# EAGLE schematic pk4017 (EAGLE 7.7.0)
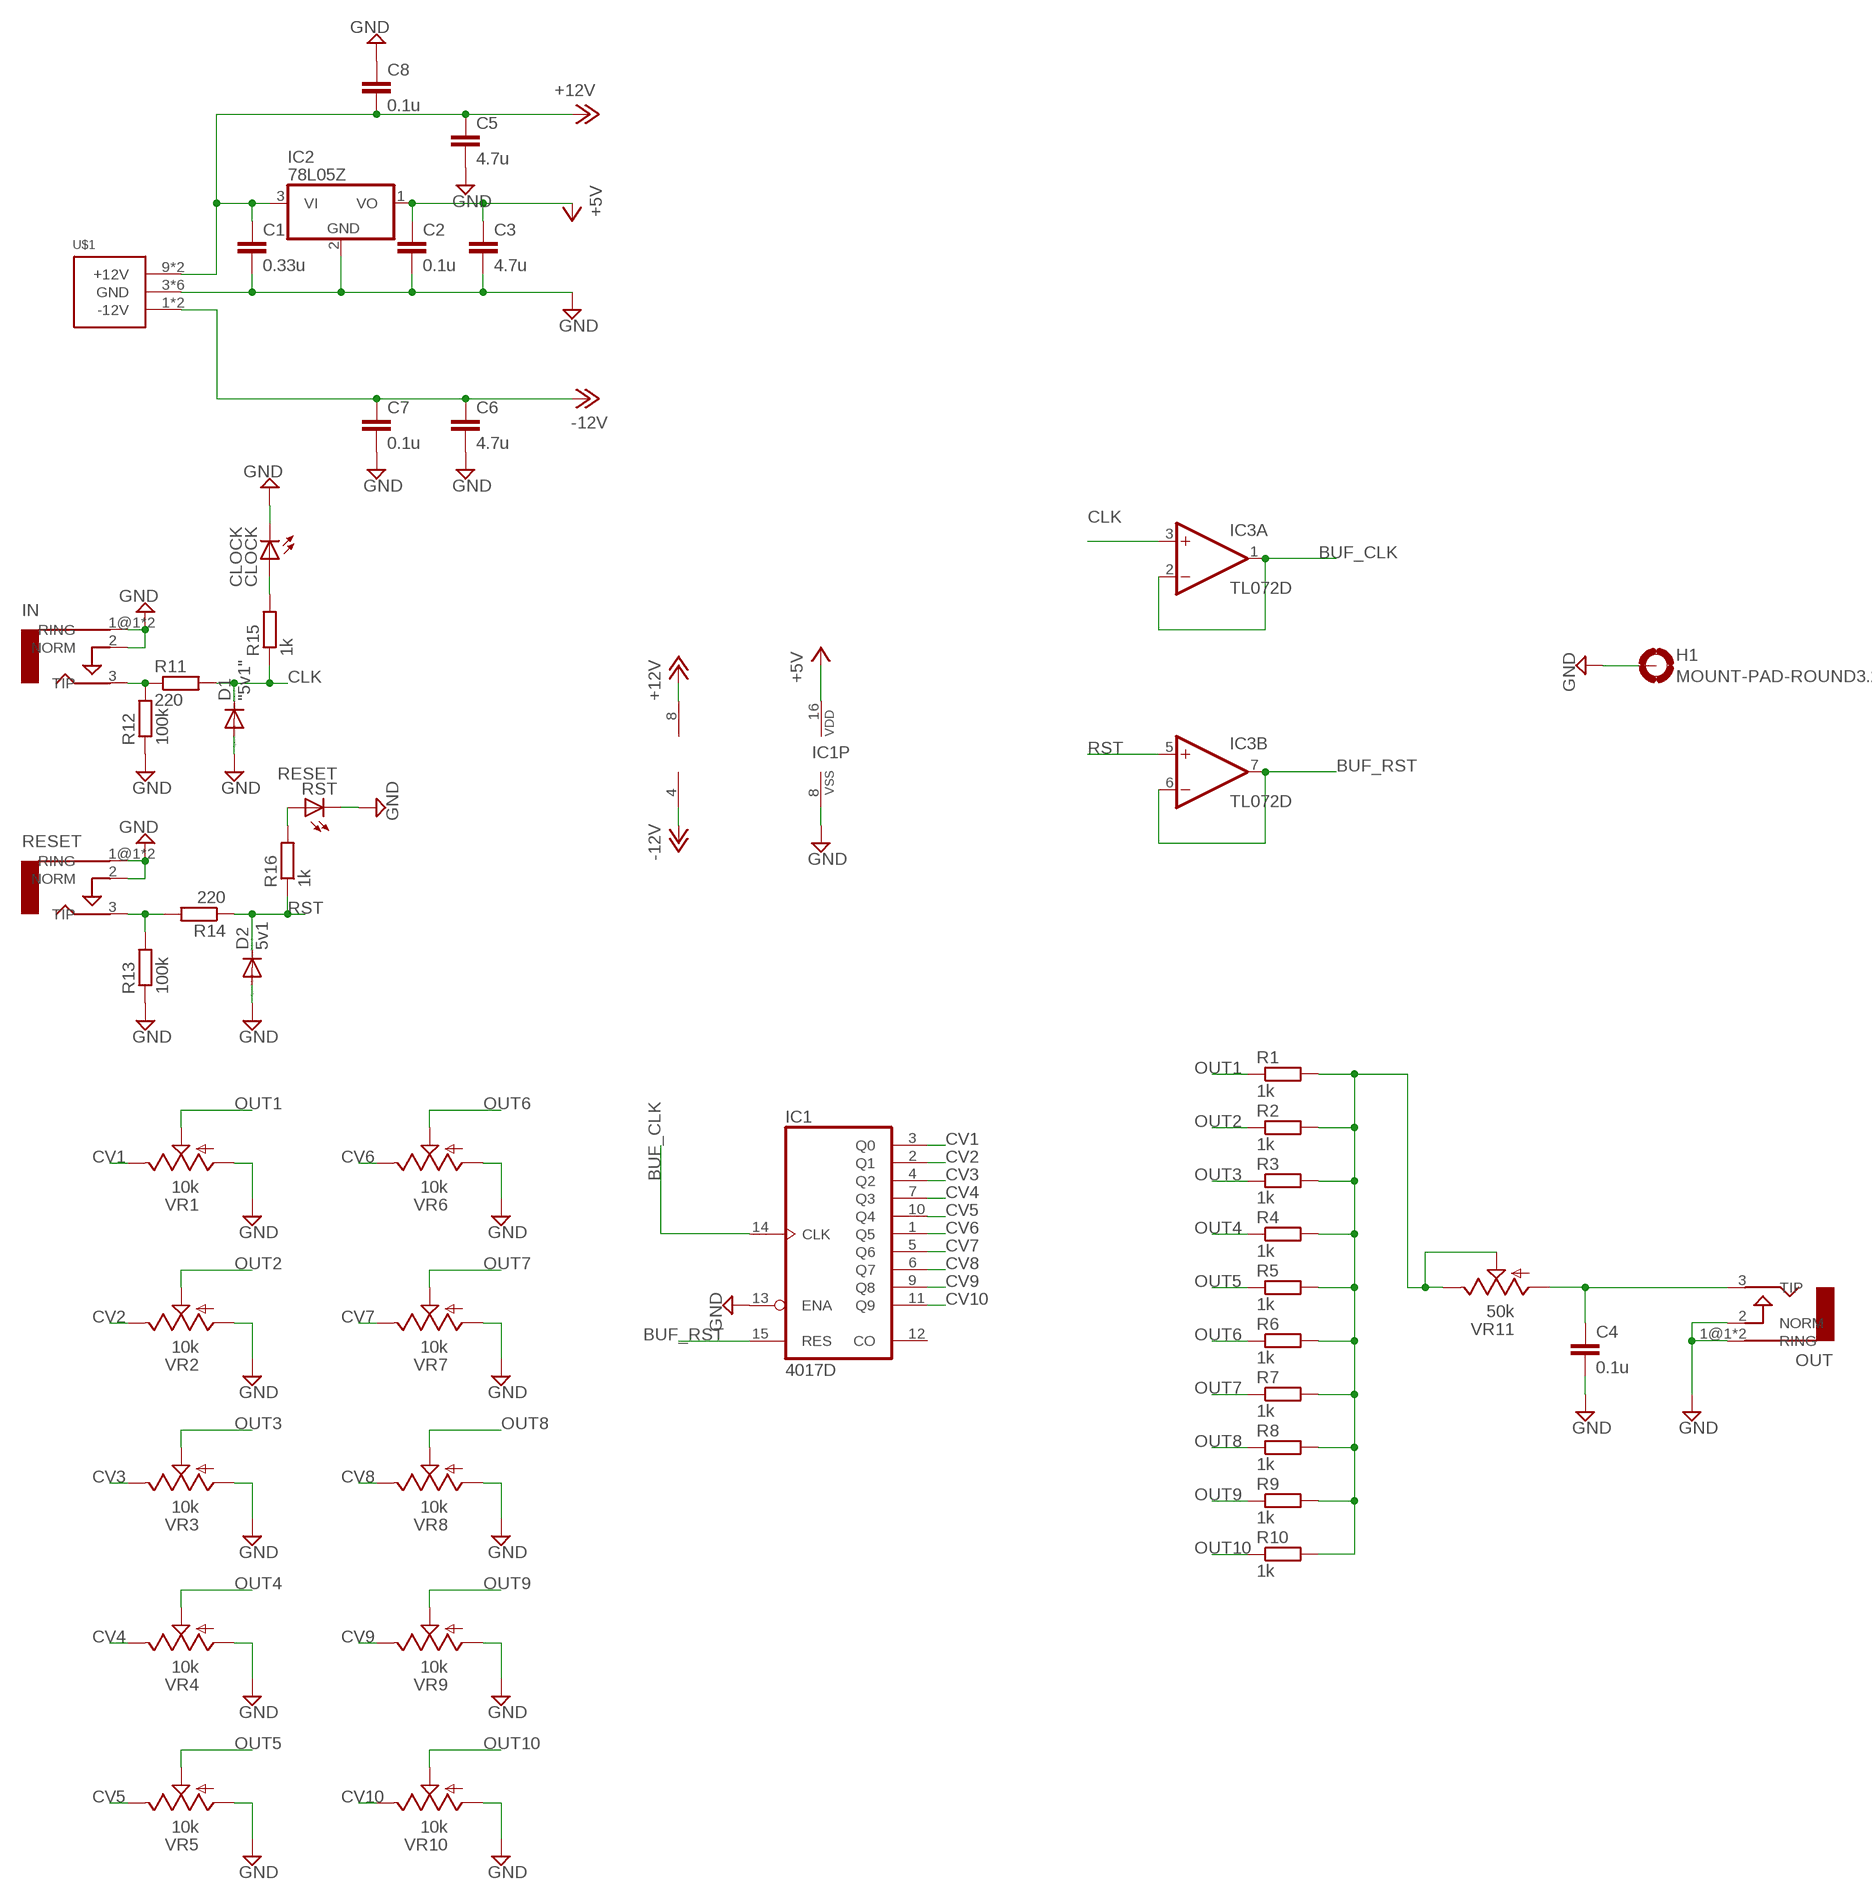
[diagram p0: schematic, sheet 1]

## Parts
C1  0.33u  C-EUC0805  [C0805]
C2  0.1u  C-EUC0805  [C0805]
C3  4.7u  C-EUC0805  [C0805]
C4  0.1u  C-EU050-025X075  [C050-025X075]
C5  4.7u  C-EUC0805  [C0805]
C6  4.7u  C-EUC0805  [C0805]
C7  0.1u  C-EUC0805  [C0805]
C8  0.1u  C-EUC0805  [C0805]
CLOCK  CLOCK  LED3MM  [LED3MM]
D1  "5v1"  DIODE-D-2.5  [D-2.5]
D2  5v1  DIODE-D-2.5  [D-2.5]
H1  MOUNT-PAD-ROUND3.2  [3,2-PAD]
IC1  4017D  [SO16]
IC2  78L05Z  [TO92]
IC3  TL072D  [SO08]
IN  IN  AUDIO-JACKERTHENVAR  [ERTHENVAR-JACK]
OUT  OUT  AUDIO-JACKERTHENVAR  [ERTHENVAR-JACK]
R1  1k  R-EU_R0805  [R0805]
R2  1k  R-EU_R0805  [R0805]
R3  1k  R-EU_R0805  [R0805]
R4  1k  R-EU_R0805  [R0805]
R5  1k  R-EU_R0805  [R0805]
R6  1k  R-EU_R0805  [R0805]
R7  1k  R-EU_R0805  [R0805]
R8  1k  R-EU_R0805  [R0805]
R9  1k  R-EU_R0805  [R0805]
R10  1k  R-EU_R0805  [R0805]
R11  220  R-EU_R0805  [R0805]
R12  100k  R-EU_R0805  [R0805]
R13  100k  R-EU_R0805  [R0805]
R14  220  R-EU_R0805  [R0805]
R15  1k  R-EU_R0805  [R0805]
R16  1k  R-EU_R0805  [R0805]
RESET  RESET  AUDIO-JACKERTHENVAR  [ERTHENVAR-JACK]
RST  RESET  LED3MM  [LED3MM]
U$1  POWER_SIMPLE10  [POWER_10]
VR1  10k  9MM_SNAP-IN_POT_  [9MM_SNAP-IN_POT]
VR2  10k  9MM_SNAP-IN_POT_  [9MM_SNAP-IN_POT]
VR3  10k  9MM_SNAP-IN_POT_  [9MM_SNAP-IN_POT]
VR4  10k  9MM_SNAP-IN_POT_  [9MM_SNAP-IN_POT]
VR5  10k  9MM_SNAP-IN_POT_  [9MM_SNAP-IN_POT]
VR6  10k  9MM_SNAP-IN_POT_  [9MM_SNAP-IN_POT]
VR7  10k  9MM_SNAP-IN_POT_  [9MM_SNAP-IN_POT]
VR8  10k  9MM_SNAP-IN_POT_  [9MM_SNAP-IN_POT]
VR9  10k  9MM_SNAP-IN_POT_  [9MM_SNAP-IN_POT]
VR10  10k  9MM_SNAP-IN_POT_  [9MM_SNAP-IN_POT]
VR11  50k  9MM_SNAP-IN_POT_  [9MM_SNAP-IN_POT]

## Nets
+5V: C2.1 C3.1 IC1.16(VDD) IC2.1(VO)
+12V: C1.1 C5.1 C8.2 IC2.3(VI) IC3.8(P:V+) U$1.9(+12V) U$1.10(+12V)
-12V: C6.1 C7.1 IC3.4(P:V-) U$1.1(-12V) U$1.2(-12V)
BUF_CLK: IC1.14(CLK) IC3.1(A:OUT) IC3.2(A:-IN)
BUF_RST: IC1.15(RES) IC3.6(B:-IN) IC3.7(B:OUT)
CLK: D1.C IC3.3(A:+IN) R11.2 R15.1
CV1: IC1.3(Q0) VR1.3(E)
CV2: IC1.2(Q1) VR2.3(E)
CV3: IC1.4(Q2) VR3.3(E)
CV4: IC1.7(Q3) VR4.3(E)
CV5: IC1.10(Q4) VR5.3(E)
CV6: IC1.1(Q5) VR6.3(E)
CV7: IC1.5(Q6) VR7.3(E)
CV8: IC1.6(Q7) VR8.3(E)
CV9: IC1.9(Q8) VR9.3(E)
CV10: IC1.11(Q9) VR10.3(E)
GND: C1.2 C2.2 C3.2 C4.2 C5.2 C6.2 C7.2 C8.1 CLOCK.K(C) D1.A D2.A H1.B3,2(MOUNT) IC1.8(VSS) IC1.13(ENA) IC2.2(GND) IN.1@1(RING) IN.1@2(RING) IN.2(NORM) OUT.1@1(RING) OUT.1@2(RING) OUT.2(NORM) R12.1 R13.1 RESET.1@1(RING) RESET.1@2(RING) RESET.2(NORM) RST.K(C) U$1.3(GND) U$1.4(GND) U$1.5(GND) U$1.6(GND) U$1.7(GND) U$1.8(GND) VR1.1(A) VR2.1(A) VR3.1(A) VR4.1(A) VR5.1(A) VR6.1(A) VR7.1(A) VR8.1(A) VR9.1(A) VR10.1(A)
N$1: IN.3(TIP) R11.1 R12.2
N$2: CLOCK.A R15.2
N$4: R13.2 R14.2 RESET.3(TIP)
N$5: R16.2 RST.A
N$6: C4.1 OUT.3(TIP) VR11.1(A)
N$31: R1.2 R2.2 R3.2 R4.2 R5.2 R6.2 R7.2 R8.2 R9.2 R10.2 VR11.2(S) VR11.3(E)
OUT1: R1.1 VR1.2(S)
OUT2: R2.1 VR2.2(S)
OUT3: R3.1 VR3.2(S)
OUT4: R4.1 VR4.2(S)
OUT5: R5.1 VR5.2(S)
OUT6: R6.1 VR6.2(S)
OUT7: R7.1 VR7.2(S)
OUT8: R8.1 VR8.2(S)
OUT9: R9.1 VR9.2(S)
OUT10: R10.1 VR10.2(S)
RST: D2.C IC3.5(B:+IN) R14.1 R16.1
Unconnected: IC1.12(CO)

## Library data of the parts
C1-C8 = rcl:C-EU: CAPACITOR, European symbol
CLOCK RST = led:LED: LED OSRAM: - CHIPLED LG R971, LG N971, LY N971, LG Q971, LY Q971, LO R971, LY R971 LH N974, LH R974 LS Q976, LO Q976, LY Q976 LO Q996 - Hyper CHIPLED LW Q18S LB Q993, LB Q99A, LB R99A - SideLED LS A670, LO A670, LY A670, LG A670, LP A670 LB A673, LV A673, LT A673, LW A673 LH A674 LY A675 LS A676, LA A676, LO A676, LY A676, LW A676 LS A679, LY A679, LG A679 - Hyper Micro SIDELED® LS Y876, LA Y876, LO Y876, LY Y876 LT Y87S - SmartLED LW L88C, LW L88S LB L89C, LB L89S, LG L890 LS L89K, LO L89K, LY L89K LS L896, LA L896, LO L896, LY L896 - TOPLED LS T670, LO T670, LY T670, LG T670, LP T670 LSG T670, LSP T670, LSY T670, LOP T670, LYG T670 LG T671, LOG T671, LSG T671 LB T673, LV T673, LT T673, LW T673 LH T674 LS T676, LA T676, LO T676, LY T676, LB T676, LH T676, LSB T676, LW T676 LB T67C, LV T67C, LT T67C, LS T67K, LO T67K, LY T67K, LW E67C LS E67B, LA E67B, LO E67B, LY E67B, LB E67C, LV E67C, LT E67C LW T67C LS T679, LY T679, LG T679 LS T770, LO T770, LY T770, LG T770, LP T770 LB T773, LV T773, LT T773, LW T773 LH T774 LS E675, LA E675, LY E675, LS T675 LS T776, LA T776, LO T776, LY T776, LB T776 LHGB T686 LT T68C, LB T68C - Hyper Mini TOPLED® LB M676 - Mini TOPLED Santana® LG M470 LS M47K, LO M47K, LY M47K Source: http://www.osram.convergy.de LUXEON: - LUMILED® LXK2-PW12-R00, LXK2-PW12-S00, LXK2-PW14-U00, LXK2-PW14-V00 LXK2-PM12-R00, LXK2-PM12-S00, LXK2-PM14-U00 LXK2-PE12-Q00, LXK2-PE12-R00, LXK2-PE12-S00, LXK2-PE14-T00, LXK2-PE14-U00 LXK2-PB12-K00, LXK2-PB12-L00, LXK2-PB12-M00, LXK2-PB14-N00, LXK2-PB14-P00, LXK2-PB14-Q00 LXK2-PR12-L00, LXK2-PR12-M00, LXK2-PR14-Q00, LXK2-PR14-R00 LXK2-PD12-Q00, LXK2-PD12-R00, LXK2-PD12-S00 LXK2-PH12-R00, LXK2-PH12-S00 LXK2-PL12-P00, LXK2-PL12-Q00, LXK2-PL12-R00 Source: www.luxeon.com KINGBRIGHT: KA-3528ASYC Source: www.kingbright.com
D1 D2 = diode:DIODE-: DIODE
H1 = holes:MOUNT-PAD-ROUND: MOUNTING PAD, round
IC1 = 40xx:4017: COUNTER/DIVIDER
IC2 = linear:78*: Positive VOLTAGE REGULATOR Source: http://cache.national.com/ds/LM/LM78L05.pdf http://www.fairchildsemi.com/ds/LM/LM7805.pdf
IC3 = linear:TL072: OP AMP
IN OUT RESET = erthenvar:AUDIO-JACK: Switching Mono 3.5mm Audio Jack from Erthenvar.
R1-R16 = rcl:R-EU_: RESISTOR, European symbol
U$1 = eurorack:POWER_SIMPLE
VR1-VR11 = MusicThingModular:9MM_SNAP-IN_POT: 9mm vertical snap-in pot, Alpha / Panasonic style